# EAGLE design Base (EAGLE 6.3)
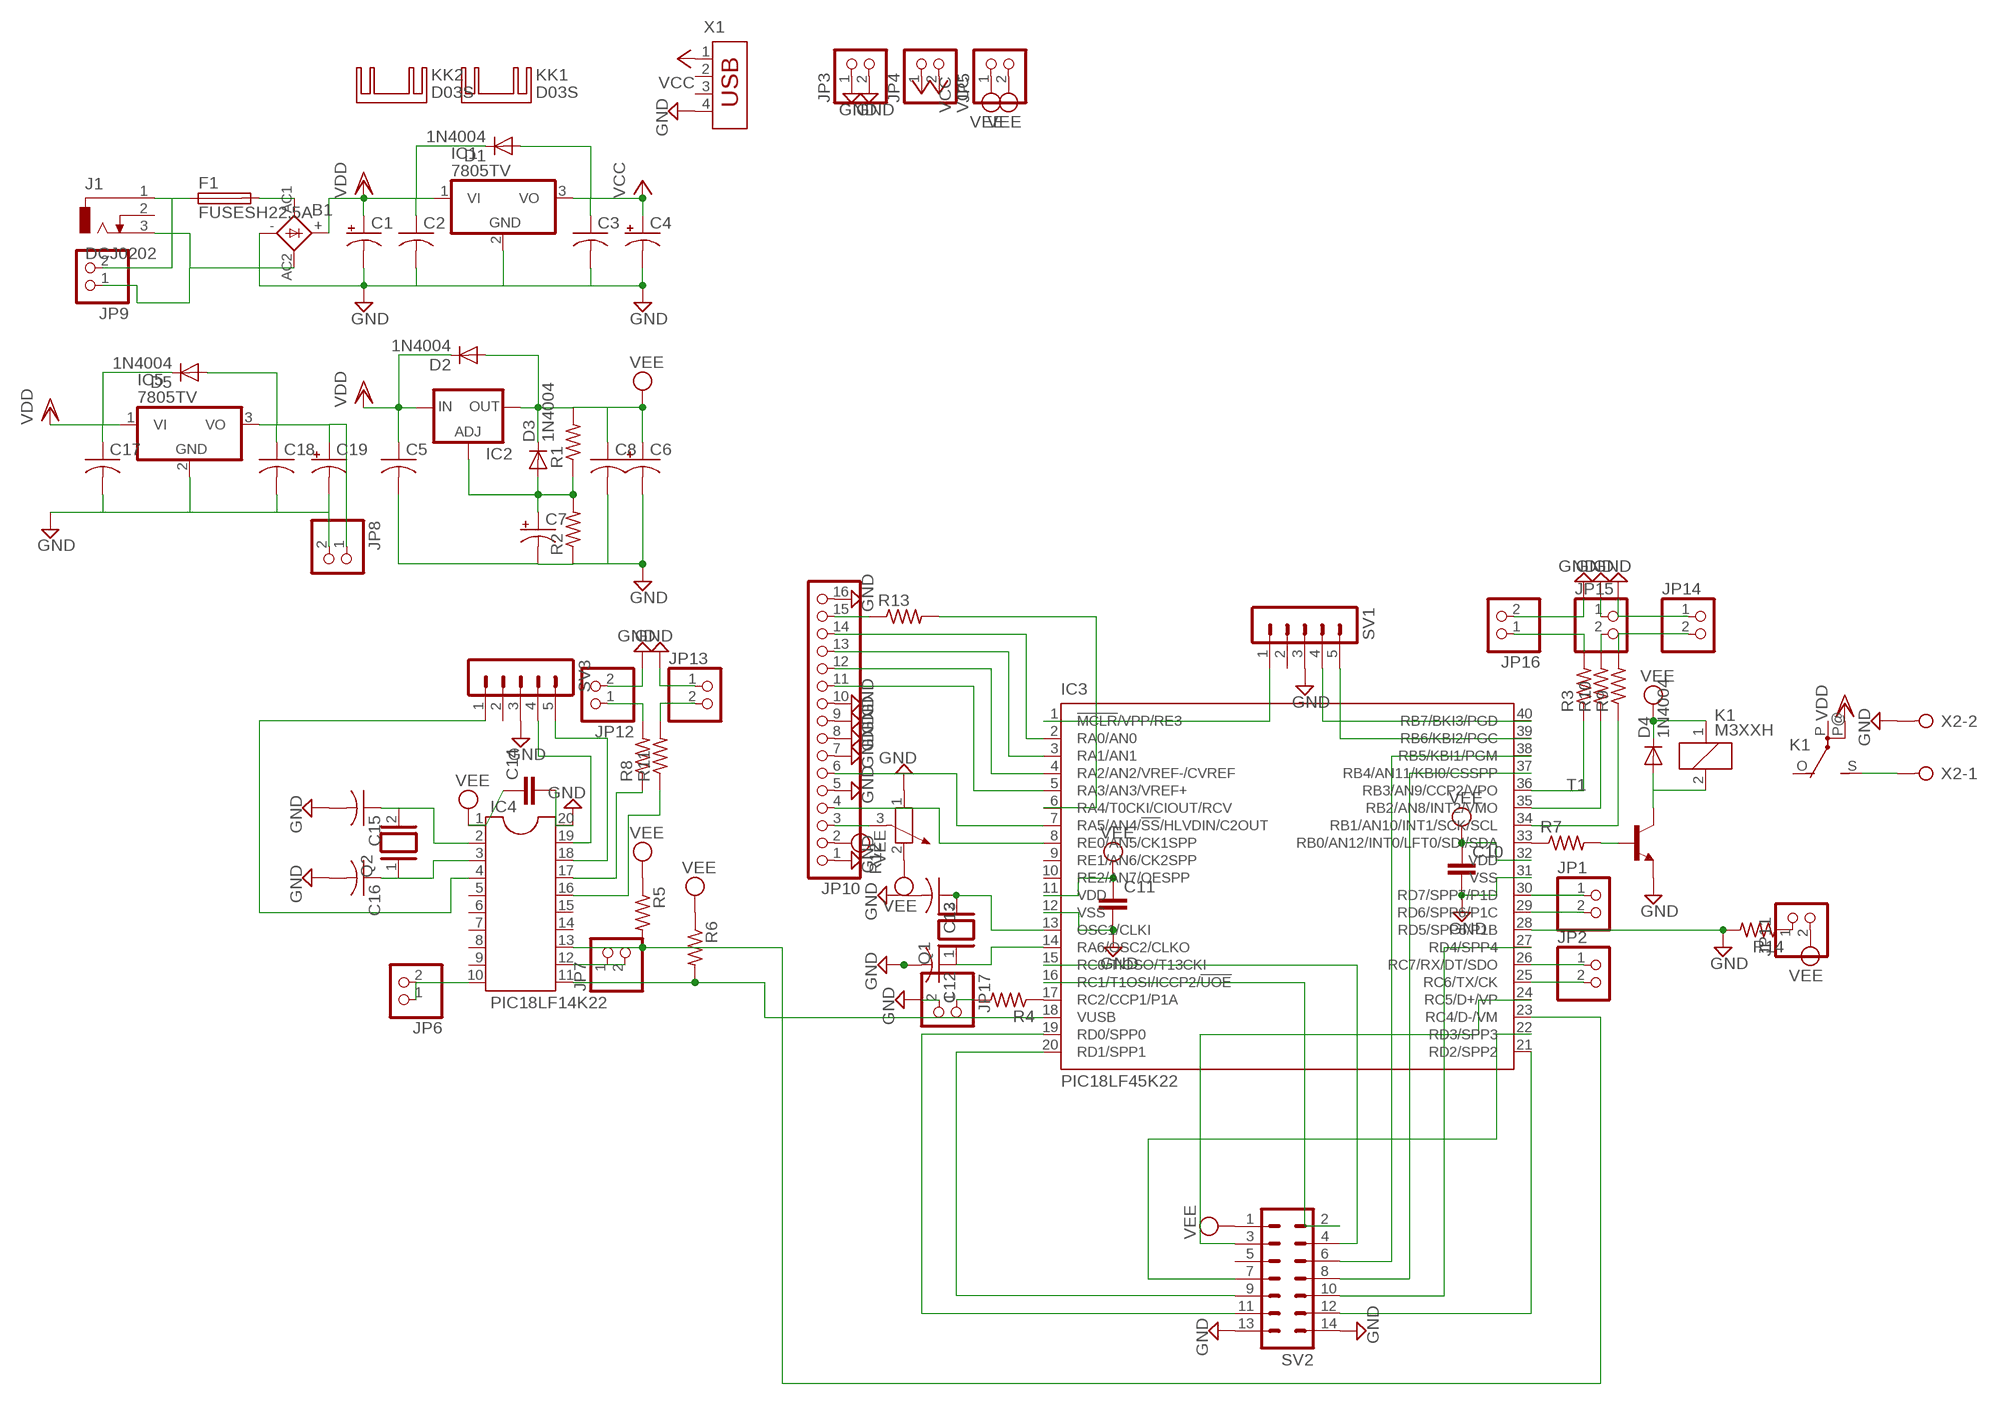
[diagram p0: schematic, sheet 1]

## Parts
B1  1KAB  [1KAB]
C1  CPOL-USE5-13  [E5-13]
C2  C-US050-030X075  [C050-030X075]
C3  C-US050-030X075  [C050-030X075]
C4  CPOL-USE5-13  [E5-13]
C5  C-US050-030X075  [C050-030X075]
C6  CPOL-USE2.5-7  [E2,5-7]
C7  CPOL-USE2.5-5  [E2,5-5]
C8  C-US050-030X075  [C050-030X075]
C10  C-EU025-030X050  [C025-030X050]
C11  C-EU025-030X050  [C025-030X050]
C12  C-US025-030X050  [C025-030X050]
C13  C-US025-030X050  [C025-030X050]
C14  C-EU025-030X050  [C025-030X050]
C15  C-US025-030X050  [C025-030X050]
C16  C-US025-030X050  [C025-030X050]
C17  C-US050-030X075  [C050-030X075]
C18  C-US050-030X075  [C050-030X075]
C19  CPOL-USE5-10.5  [E5-10,5]
D1  1N4004  [DO41-10]
D2  1N4004  [DO41-10]
D3  1N4004  [DO41-10]
D4  1N4004  [DO41-10]
D5  1N4004  [DO41-10]
F1  FUSESH22,5A  [SH22,5A]
IC1  7805TV  [TO220V]
IC2  LM317TS  [317TS]
IC3  PIC18LF45K22  PIC18F4550_40  [DIL40]
IC4  PIC18LF14K22  DIL20  [DIL20]
IC5  7805TV  [TO220V]
J1  DCJ0202  [DCJ0202]
JP1  PINHD-1X2  [1X02]
JP2  PINHD-1X2  [1X02]
JP3  PINHD-1X2  [1X02]
JP4  PINHD-1X2  [1X02]
JP5  PINHD-1X2  [1X02]
JP6  PINHD-1X2  [1X02]
JP7  PINHD-1X2  [1X02]
JP8  PINHD-1X2  [1X02]
JP9  PINHD-1X2  [1X02]
JP10  PINHD-1X16  [1X16]
JP11  PINHD-1X2  [1X02]
JP12  PINHD-1X2  [1X02]
JP13  PINHD-1X2  [1X02]
JP14  PINHD-1X2  [1X02]
JP15  PINHD-1X2  [1X02]
JP16  PINHD-1X2  [1X02]
JP17  PINHD-1X2  [1X02]
K1  M3XXH  [M3XXH]
KK1  D03S  [D03S]
KK2  D03S  [D03S]
Q1  XTAL/S  [QS]
Q2  XTAL/S  [QS]
R1  R-US_0207/10  [0207/10]
R2  R-US_0207/10  [0207/10]
R3  R-US_0207/10  [0207/10]
R4  R-US_0207/10  [0207/10]
R5  R-US_0207/10  [0207/10]
R6  R-US_0207/10  [0207/10]
R7  R-US_0207/10  [0207/10]
R8  R-US_0207/10  [0207/10]
R9  R-US_0207/10  [0207/10]
R10  R-US_0207/10  [0207/10]
R11  R-US_0207/10  [0207/10]
R12  POTENTIOMETER_PT-10  [PT-10]
R13  R-US_0207/10  [0207/10]
R14  R-US_0207/10  [0207/10]
SV1  MA05-1  [MA05-1]
SV2  MA07-2  [MA07-2]
SV3  MA05-1  [MA05-1]
T1  BC547-NPN-TO92-CBE  [TO92-CBE]
X1  USB-787616  [USB]
X2  W237-02P  [W237-132]

## Nets
GND: B1.- C1.- C2.2 C3.2 C4.- C5.2 C6.- C7.- C8.2 C10.2 C11.2 C12.2 C13.2 C14.2 C15.2 C16.2 C17.2 C18.2 C19.- IC1.2(GND) IC3.12(VSS) IC3.28(RD5/SPP5/P1B) IC3.31(VSS) IC4.20 IC5.2(GND) JP3.1 JP3.2 JP8.2 JP10.1 JP10.5 JP10.7 JP10.8 JP10.9 JP10.10 JP10.16 JP12.2 JP13.1 JP14.1 JP15.1 JP16.2 JP17.2 R2.1 R12.1 R14.2 SV1.3 SV2.13 SV2.14 SV3.3 T1.E X1.4 X2.2
N$1: F1.1 J1.1 JP9.2
N$2: B1.AC1 F1.2
N$3: B1.AC2 J1.3 JP9.1
N$4: IC3.1(!MCLR!/VPP/RE3) SV1.1
N$5: C7.+ D3.A IC2.1(ADJ) R1.1 R2.2
N$6: IC3.40(RB7/BKI3/PGD) SV1.4
N$7: IC3.39(RB6/KBI2/PGC) SV1.5
N$8: C13.1 IC3.13(OSC1/CLKI) Q1.2
N$9: C12.1 IC3.14(RA6/OSC2/CLKO) Q1.1
N$10: JP16.1 R3.2
N$11: IC3.26(RC7/RX/DT/SDO) JP2.1
N$12: IC3.25(RC6/TX/CK) JP2.2
N$13: IC3.30(RD7/SPP7/P1D) JP1.1
N$14: IC3.29(RD6/SPP6/P1C) JP1.2
N$15: JP15.2 R10.2
N$16: JP14.2 R9.2
N$17: JP12.1 R8.2
N$18: IC3.19(RD0/SPP0) SV2.11
N$19: IC3.20(RD1/SPP1) SV2.9
N$20: IC3.27(RD4/SPP4) SV2.10
N$21: IC4.19 SV3.4
N$22: IC4.18 SV3.5
N$23: C15.1 IC4.2 Q2.2
N$24: C16.1 IC4.3 Q2.1
N$25: IC4.4 SV3.1
N$26: IC3.23(RC4/D-/VM) IC4.13 R5.2
N$27: IC3.18(VUSB) IC4.11 R6.2
N$28: IC3.16(RC1/T1OSI/ICCP2/!UOE) SV2.2
N$29: R7.2 T1.B
N$30: D4.A K1.2 T1.C
N$31: K1.S(2:S) X2.1
N$32: IC3.21(RD2/SPP2) SV2.12
N$33: IC3.37(RB4/AN11/KBI0/CSSPP) SV2.8
N$34: IC3.38(RB5/KBI1/PGM) SV2.6
N$35: JP13.2 R11.2
N$36: IC4.10 JP6.1 JP6.2
N$37: C18.1 C19.+ D5.A IC5.3(VO) JP8.1
N$38: IC3.15(RC0/TIOSO/T13CKI) SV2.4
N$39: IC3.24(RC5/D+/VP) SV2.3
N$40: IC3.22(RD3/SPP3) SV2.7
N$41: IC3.33(RB0/AN12/INT0/LFT0/SDI/SDA) R7.1
N$42: IC3.34(RB1/AN10/INT1/SCK/SCL) R9.1
N$43: IC4.12 JP7.1 JP7.2
N$44: IC3.35(RB2/AN8/INT2/VMO) R10.1
N$45: IC3.36(RB3/AN9/CCP2/VPO) R3.1
N$46: JP17.1 R4.2
N$47: IC4.17 R8.1
N$48: IC4.16 R11.1
N$49: IC3.2(RA0/AN0) JP10.14
N$50: JP10.3 R12.3
N$51: IC3.7(RA5/AN4/!SS!/HLVDIN/C2OUT) JP10.6
N$52: IC3.8(RE0/AN5/CK1SPP) JP10.4
N$53: IC3.3(RA1/AN1) JP10.13
N$54: IC3.4(RA2/AN2/VREF-/CVREF) JP10.12
N$55: IC3.5(RA3/AN3/VREF+) JP10.11
N$56: IC3.6(RA4/T0CKI/CIOUT/RCV) R13.2
N$57: JP10.15 R13.1
N$58: JP11.1 R14.1
N$59: IC3.17(RC2/CCP1/P1A) R4.1
VCC: C3.1 C4.+ D1.A IC1.3(VO) JP4.1 JP4.2 X1.1
VDD: B1.+ C1.+ C2.1 C5.1 C17.1 D1.C D2.C D5.C IC1.1(VI) IC2.3(IN) IC5.1(VI) K1.P@(2:P)
VEE: C6.+ C8.1 C10.1 C11.1 C14.1 D2.A D3.C D4.C IC2.2(OUT) IC3.11(VDD) IC3.32(VDD) IC4.1 JP5.1 JP5.2 JP10.2 JP11.2 K1.1 R1.2 R5.1 R6.1 R12.2 SV2.1
Unconnected: IC3.9(RE1/AN6/CK2SPP) IC3.10(RE2/AN7/OESPP) IC4.5 IC4.6 IC4.7 IC4.8 IC4.9 IC4.14 IC4.15 J1.2 K1.O(2:O) K1.P(2:P) SV1.2 SV2.5 SV3.2 X1.2 X1.3

## Library data of the parts
B1 = rectifier:1KAB: RECTIFIER grid 5,08 x 5,08 mm
C1 C4 C6 C7 C19 = rcl:CPOL-US: POLARIZED CAPACITOR, American symbol
C2 C3 C5 C8 C12 C13 C15-C18 = rcl:C-US: CAPACITOR, American symbol
C10 C11 C14 = rcl:C-EU: CAPACITOR, European symbol
D1-D5 = diode:1N4004: DIODE general purpose rectifier, 1 A
F1 = fuse:FUSE: Fuse; OC_FARNELL: unknown; OC_NEWARK: unknown
IC1 IC5 = linear:78*: Positive LDO VOLTAGE REGULATOR Source: http://ww1.microchip.com/downloads/en/DeviceDoc/21983A.pdf
IC2 = v-reg:LM317TS: VOLTAGE REGULATOR
IC3 = microchip:PIC18F4*_40: USB Microcontrollers with nanoWatt Technology High-Performance, Enhanced Flash, 28/40/44-Pin, Source: http://ww1.microchip.com/downloads/en/devicedoc/39632c.pdf; MF: MICROCHIP; MPN: PIC18F4550-I/P; OC_FARNELL: 9321357; OC_NEWARK: 74K8623
IC4 = ic-package:DIL20: Dual In Line / Socket
J1 = con-jack:DCJ0202: DC POWER JACK Source: DCJ0202.pdf; OC_FARNELL: unknown; OC_NEWARK: unknown
JP1-JP9 JP11-JP17 = pinhead:PINHD-1X2: PIN HEADER
JP10 = pinhead:PINHD-1X16: PIN HEADER
K1 = relay:M3XXH: RELAY 1 x switch; OC_FARNELL: unknown; OC_NEWARK: unknown
KK1 KK2 = heatsink:D03S: HEATSINK distributor Schukat
Q1 Q2 = special:XTAL/S: CRYSTAL
R1-R11 R13 R14 = resistor:R-US_: RESISTOR, American symbol
R12 = rcl:POTENTIOMETER_: Potentiometer
SV1 SV3 = con-lstb:MA05-1: PIN HEADER; OC_FARNELL: unknown; OC_NEWARK: unknown
SV2 = con-lstb:MA07-2: PIN HEADER; OC_FARNELL: unknown; OC_NEWARK: unknown
T1 = transistor:*-NPN-: NPN Transistror BF959 corrected 2008.03.06
X1 = con-amp:USB-787616: AMP connector
X2 = con-wago-508:W237-02P: WAGO SREW CLAMP; OC_FARNELL: unknown; OC_NEWARK: unknown

## Board
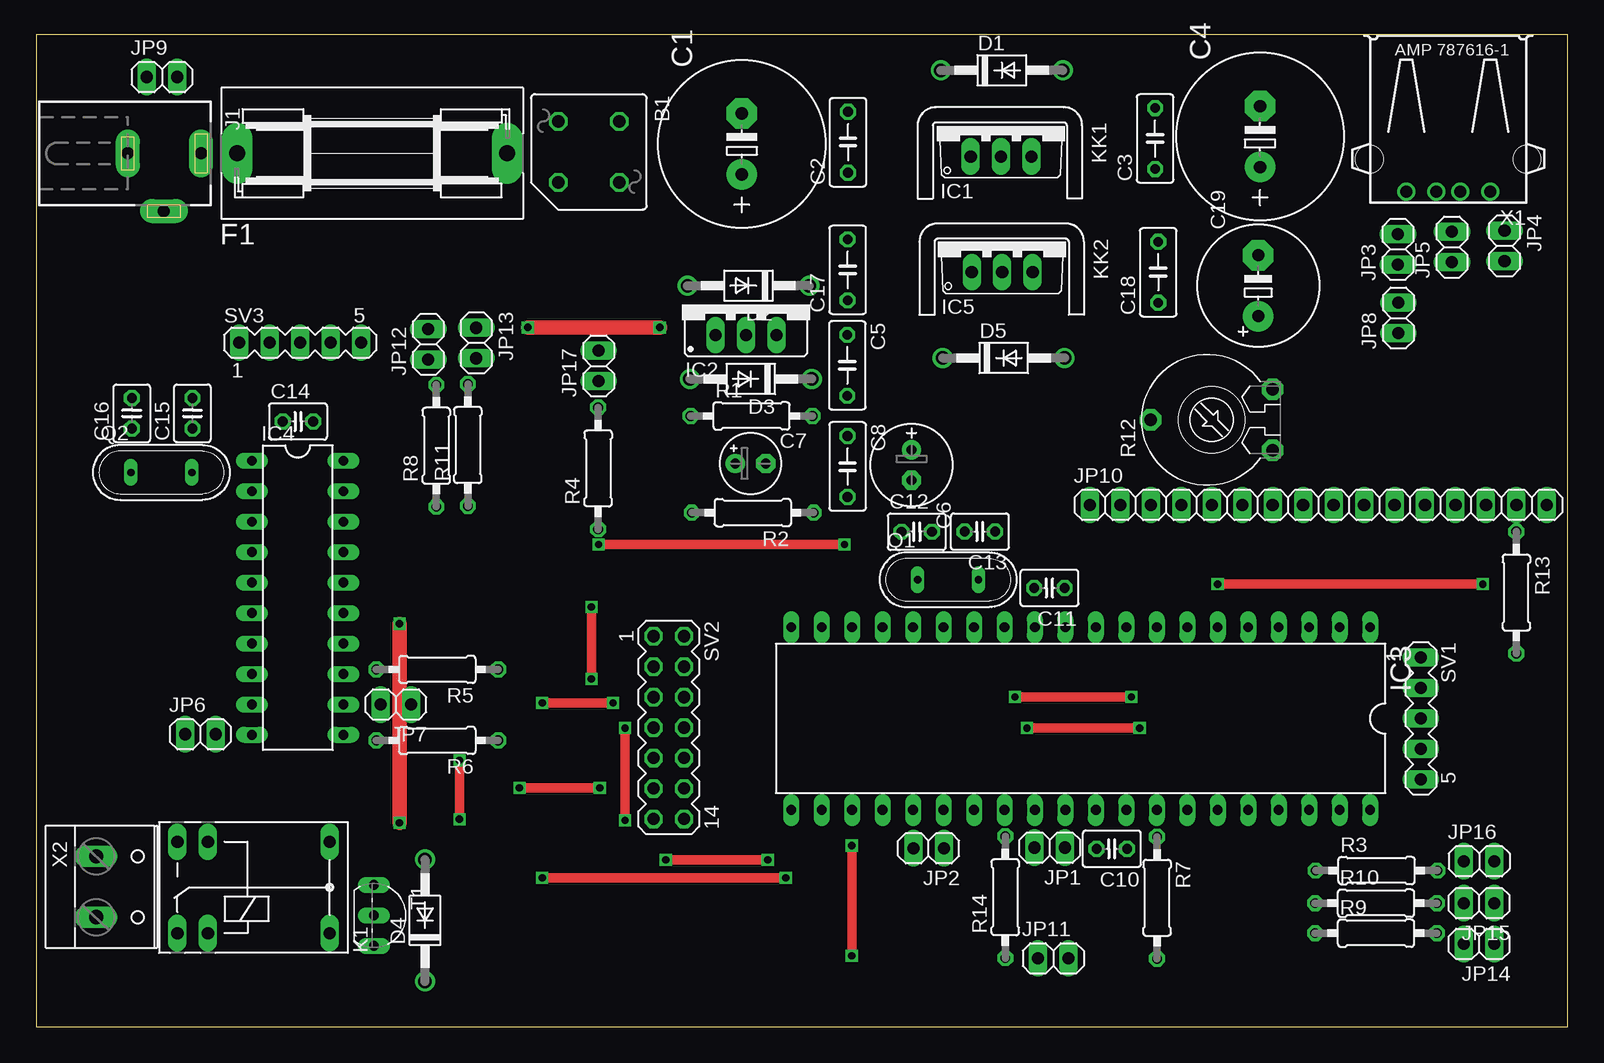
[diagram p1: board, top side]
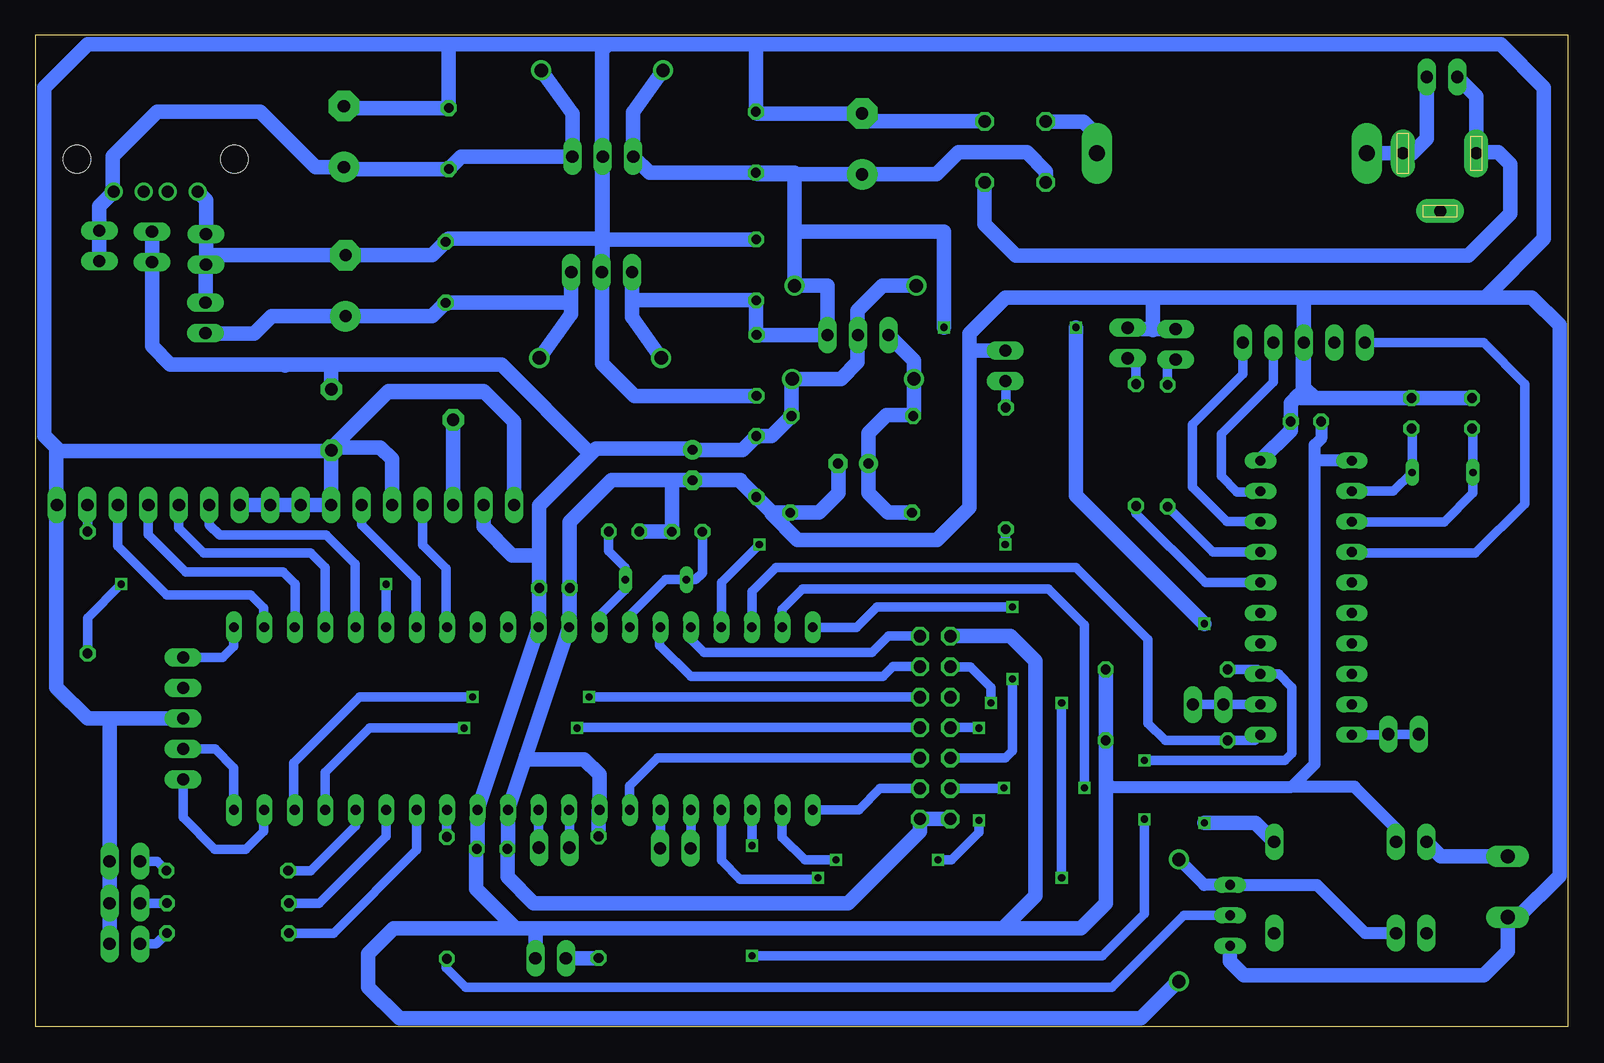
[diagram p2: board, bottom side, seen from below]

Size 127.7 x 82.7 mm. Coordinates in mm from the lower left corner, seen from the top.
Outline: 0,0 127.7,0 127.7,82.7 0,82.7 0,0
Copper layers (1*16): Top 0.035mm / dielectric 1.5mm / Bottom 0.035mm
Design rules "default": minimum track width 10mil, minimum drill 24mil, track to track 8mil, track to pad 8mil, pad to pad 8mil, via to via 8mil, smd to smd 8mil, copper to edge 40mil, drill to drill 8mil, minimum pad ring 10mil, minimum via ring 8mil, stop-mask expansion 4mil, vias tented up to drill 0mil, thermal gap 10mil

### Footprints (pad centres in the part's own frame; a part is rotated, then mirrored left to right if it is on the bottom)
1KAB = drill 1.016 octagon: + 2.54,-2.54; - -2.54,2.54; AC1 -2.54,-2.54; AC2 2.54,2.54
E5-13 = drill 1.016 pad 2.54: + -2.54,0 | drill 1.016 pad 2.54 octagon: - 2.54,0
C050-030X075 = drill 0.813 octagon: 1 -2.54,0; 2 2.54,0
E2,5-7 = drill 0.813 pad 1.6: + -1.27,0 | drill 0.813 pad 1.6 octagon: - 1.27,0
E2,5-5 = drill 0.813 pad 1.6: + -1.27,0 | drill 0.813 pad 1.6 octagon: - 1.27,0
C025-030X050 = drill 0.813 octagon: 1 -1.27,0; 2 1.27,0
E5-10,5 = drill 1.016 pad 2.54: + -2.54,0 | drill 1.016 pad 2.54 octagon: - 2.54,0
DO41-10 = drill 1.118: A 5.08,0; C -5.08,0
SH22,5A = drill 1.321 pad 2.54 long: 1 -11.252,0; 2 11.252,0
TO220V = drill 1.016 long: 1 -2.54,-2.54; 2 0,-2.54; 3 2.54,-2.54
317TS = drill 1.016 long: 1 -2.54,-2.54; 2 0,-2.54; 3 2.54,-2.54
DIL40 = drill 0.813 long: 1 -24.13,-7.62; 2 -21.59,-7.62; 3 -19.05,-7.62; 4 -16.51,-7.62; 5 -13.97,-7.62; 6 -11.43,-7.62; 7 -8.89,-7.62; 8 -6.35,-7.62; 9 -3.81,-7.62; 10 -1.27,-7.62; 11 1.27,-7.62; 12 3.81,-7.62; 13 6.35,-7.62; 14 8.89,-7.62; 15 11.43,-7.62; 16 13.97,-7.62; 17 16.51,-7.62; 18 19.05,-7.62; 19 21.59,-7.62; 20 24.13,-7.62; 21 24.13,7.62; 22 21.59,7.62; 23 19.05,7.62; 24 16.51,7.62; 25 13.97,7.62; 26 11.43,7.62; 27 8.89,7.62; 28 6.35,7.62; 29 3.81,7.62; 30 1.27,7.62; 31 -1.27,7.62; 32 -3.81,7.62; 33 -6.35,7.62; 34 -8.89,7.62; 35 -11.43,7.62; 36 -13.97,7.62; 37 -16.51,7.62; 38 -19.05,7.62; 39 -21.59,7.62; 40 -24.13,7.62
DIL20 = drill 0.813 long: 1 -11.43,-3.81; 2 -8.89,-3.81; 3 -6.35,-3.81; 4 -3.81,-3.81; 5 -1.27,-3.81; 6 1.27,-3.81; 7 3.81,-3.81; 8 6.35,-3.81; 9 8.89,-3.81; 10 11.43,-3.81; 11 11.43,3.81; 12 8.89,3.81; 13 6.35,3.81; 14 3.81,3.81; 15 1.27,3.81; 16 -1.27,3.81; 17 -3.81,3.81; 18 -6.35,3.81; 19 -8.89,3.81; 20 -11.43,3.81
DCJ0202 = drill 1 pad 2 long: 1 0,3.1; 2 4.8,0; 3 0,-3
1X02 = drill 1.016 long: 1 -1.27,0; 2 1.27,0
1X16 = drill 1.016 long: 1 -19.05,0; 2 -16.51,0; 3 -13.97,0; 4 -11.43,0; 5 -8.89,0; 6 -6.35,0; 7 -3.81,0; 8 -1.27,0; 9 1.27,0; 10 3.81,0; 11 6.35,0; 12 8.89,0; 13 11.43,0; 14 13.97,0; 15 16.51,0; 16 19.05,0
M3XXH = drill 1.016 long: 1 -3.81,3.81; 2 -3.81,-3.81; O -6.35,-3.81; P 6.35,-3.81; P@ 6.35,3.81; S -6.35,3.81
QS = drill 0.61 long: 1 -2.54,0; 2 2.54,0
0207/10 = drill 0.813 octagon: 1 -5.08,0; 2 5.08,0
PT-10 = drill 1.016 pad 1.778 octagon: 1 -2.54,-5.08; 2 2.54,-5.08; 3 0,5.08
MA05-1 = drill 1.016 long: 1 -5.08,0; 2 -2.54,0; 3 0,0; 4 2.54,0; 5 5.08,0
MA07-2 = drill 1.016 octagon: 1 -7.62,-1.27; 2 -7.62,1.27; 3 -5.08,-1.27; 4 -5.08,1.27; 5 -2.54,-1.27; 6 -2.54,1.27; 7 0,-1.27; 8 0,1.27; 9 2.54,-1.27; 10 2.54,1.27; 11 5.08,-1.27; 12 5.08,1.27; 13 7.62,-1.27; 14 7.62,1.27
TO92-CBE = drill 0.813 long: B 0,0; C -2.54,0; E 2.54,0
USB = drill 1: 1 -3.5,12.99; 2 -1,12.99; 3 1,12.99; 4 3.5,12.99 | hole 2.3: -6.57,10.28; 6.57,10.28
W237-132 = drill 1.194 long: 1 -2.54,-0.635; 2 2.54,-0.635

### Placement (x,y rotation side)
B1  46.08,72.93 270 top
C1  58.84,73.6 90 top
C2  67.69,73.74 90 top
C3  93.29,74.05 90 top
C4  102.04,74.21 90 top
C5  67.63,55.14 270 top
C6  72.98,46.83 270 top
C7  59.57,46.96 0 top
C8  67.65,46.71 270 top
C10  89.68,14.83 180 top
C11  84.48,36.58 180 top
C12  73.42,41.27 0 top
C13  78.68,41.28 180 top
C14  21.84,50.46 0 top
C15  13.04,51.14 90 top
C16  7.99,51.14 90 top
C17  67.66,63.1 90 top
C18  93.55,62.9 90 top
C19  101.89,61.78 90 top
D1  80.51,79.74 0 top
D2  59.39,61.78 180 top
D3  59.59,54 180 top
D4  32.43,8.86 90 top
D5  80.66,55.75 0 top
F1  28.02,72.82 0 top
IC1  80.45,75.09 0 top
IC2  59.19,60.2 0 top
IC3  87.08,25.69 180 top
IC4  21.82,35.76 270 top
IC5  80.54,65.45 0 top
J1  10.65,72.81 270 top
JP1  84.51,14.93 180 top
JP2  74.41,14.88 180 top
JP3  113.53,64.81 90 top
JP4  122.42,65.09 270 top
JP5  118.03,65.01 90 top
JP6  13.7,24.39 0 top
JP7  30,26.86 180 top
JP8  113.57,59.1 90 top
JP9  10.5,79.18 0 top
JP10  106.9,43.5 0 top
JP11  84.8,5.7 0 top
JP12  32.7,56.9 90 top
JP13  36.7,57 270 top
JP14  120.3,6.9 180 top
JP15  120.3,10.3 180 top
JP16  120.3,13.8 0 top
JP17  46.9,55.1 90 top
K1  18.14,11.61 0 top
KK1  80.35,75.39 180 top
KK2  80.5,65.7 180 top
Q1  76.03,37.27 0 top
Q2  10.45,46.21 0 top
R1  59.65,50.92 0 top
R2  59.75,42.86 180 top
R3  111.75,13.02 0 top
R4  46.86,46.55 90 top
R5  33.45,29.79 180 top
R6  33.45,23.87 180 top
R7  93.45,10.75 270 top
R8  33.37,48.44 90 top
R9  111.7,7.8 0 top
R10  111.7,10.3 0 top
R11  36,48.5 90 top
R12  98,50.6 90 top
R13  123.4,36.2 270 top
R14  80.8,10.8 90 top
SV1  115.44,25.7 270 top
SV2  52.75,24.94 270 top
SV3  22.02,57.03 0 top
T1  28.16,9.28 270 top
X1  117.72,82.61 180 top
X2  5.65,11.67 270 top

### Tracks (layer width: path | path; a pad name or v marks a point on that pad's centre or on a via)
GND
  Bottom 1.2: B1.- 48.66,75.51 58.21,75.51 C1.- 67.55,76.14 C2.2 67.69,81.59 68,81.9 | 80.45,65.7 IC1.2 80.4,72.6 | 80.45,65.7 80.45,63 IC5.2 80.5,62.87 | C7.- 60.8,46.92 60.8,44.5 62.44,42.86 R2.1 66.34,42.86 C8.2 69.04,45.56 | 69.04,45.56 C6.- 73.02,45.6 | C17.2 80.39,65.64 80.45,65.7 | 80.45,65.7 93.29,65.7 C18.2 94.67,64.32 C19.- 113.51,64.32 113.53,64.3 | 113.53,64.3 JP3.2 113.53,68.93 X1.4 | 113.53,64.3 JP3.1 113.57,63.5 JP8.2 | 69.04,45.56 68.96,45.56 | 34.6,60.8 46.9,60.8 49.9,57.8 49.9,56.3 | 34.6,60.8 22,60.8 | 22,60.8 6.9,60.8 | 6.9,60.8 2,65.7 2,78.3 5.6,81.9 68,81.9 | 68,81.9 80,81.9 | 80,81.9 93,81.9 | 93,81.9 123.4,81.9 127,78.3 127,49.3 126,48.3 | 86.85,22.58 IC3.12 83.21,33.37 C11.2 83.21,42.09 79.7,45.6 75,45.6 | 86.85,22.58 IC3.31 88.35,14.89 C10.2 88.4,12.5 86.2,10.3 60,10.3 54,16.3 54,17.3 53.98,17.32 SV2.13 SV2.14 | 75,45.6 73.02,45.6 | IC4.20 23.11,49.71 C14.2 23.11,51.99 22.45,52.65 | C16.2 C15.2 22.21,52.41 22.45,52.65 | 22.45,52.65 22.1,53 22.1,56.95 SV3.3 | C16.2 | C16.2 21.11,52.41 22,53.3 22,60.8 | T1.E 28.16,5.46 27,4.3 7,4.3 5,6.3 5,9.12 X2.2 4.17,9.13 0.7,12.6 0.7,58.5 3,60.8 6.9,60.8 | C13.2 C12.2 74.69,45.29 75,45.6 | 34.6,58.1 34.6,58.3 | 34.6,58.3 34.6,60.8 | 115.54,25.6 SV1.3 122,25.7 | 122,25.7 123.4,25.7 126,28.3 126,43.45 JP10.16 126,42.25 126,48.3 | C4.- 101.88,76.59 C3.2 93.29,81.61 93,81.9 | 80.5,62.87 80.5,55.3 77.8,52.6 C5.2 | 73.02,45.6 69.1,45.6 66.4,42.9 66.4,42.8 64.2,40.6 52.6,40.6 49.9,43.3 49.9,56.3 | JP10.10 JP10.9 JP10.8 JP10.7 R12.1 | 90.3,52.9 90.4,53 98.3,53 103,48.3 103,48.14 R12.1 | JP10.5 98.01,47.31 99,48.3 102.84,48.3 R12.1 | JP10.1 87.85,50.45 90.3,52.9
  Bottom 1.2: 90.3,52.9 98.4,52.9 103.3,48 125.7,48 126,48.3 | R14.2 80.8,18 IC3.28 80.73,21.03 82,22.3 86.56,22.3 86.85,22.58 | JP13.1 36.6,58.17 JP12.2 34.47,58.17 34.6,58.3 | JP16.2 JP15.1 JP14.1 121.57,25.27 122,25.7 | JP17.2 49.83,56.37 49.9,56.3 | 80.5,62.87 80.5,81.4 80,81.9
N$1
  Bottom 1.2: F1.1 14.66,72.81 J1.1 13,72.8 11.77,74.03 JP9.2
N$2
  Bottom 1.2: B1.AC1 40.37,75.47 39.3,74.4 39.3,72.85 F1.2
N$3
  Bottom 1.2: 7.65,73.3 J1.3 | 7.65,73.3 7.65,77.6 JP9.1 | B1.AC2 48.62,66.92 46,64.3 8.3,64.3 4.8,67.8 4.8,71.9 5.8,72.9 7.25,72.9 7.65,73.3
N$4
  Bottom 0.8: SV1.1 112.12,30.78 111.2,31.7 IC3.1
N$5
  Bottom 1.2: IC2.1 54.51,55.52 D3.A 54.51,50.98 R1.1 54.65,51 56.8,51 58.3,49.5 C7.+ 58.3,44.5 56.66,42.86 R2.2
N$6
  Bottom 0.8: SV1.4 112.76,23.16 111.2,21.6 IC3.40
N$7
  Bottom 0.8: SV1.5 115.44,17.44 112.8,14.8 110.2,14.8 108.7,16.3 108.7,18.04 IC3.39
N$8
  Bottom 0.8: C13.1 79.95,39.65 78.6,38.3 78.6,37.3 | 78.6,37.3 Q1.2 | 78.6,37.3 78.6,36.4 80.7,34.3 80.7,33.34 IC3.13
N$9
  Bottom 0.8: IC3.14 78.2,34.3 75.23,37.27 Q1.1 73.46,37.3 72.7,37.3 72.15,37.85 C12.1
N$10
  Bottom 0.8: JP16.1 117.61,13.8 R3.2
N$11
  Bottom 0.8: JP2.1 75.65,14.88 IC3.26
N$12
  Bottom 0.8: JP2.2 73.11,14.88 IC3.25
N$13
  Bottom 0.8: IC3.30 85.81,14.96 JP1.1
N$14
  Bottom 0.8: JP1.2 83.24,18.04 IC3.29
N$15
  Bottom 0.8: JP15.2 R10.2
N$16
  Bottom 0.8: JP14.2 117.68,6.9 R9.2
N$17
  Bottom 0.8: R8.2 33.37,54.96 JP12.1
N$18  (via drill 0.6)
  Top 0.8: v47,19.9 v40.3,19.9
  Bottom 0.8: SV2.11 47.04,19.86 v47,19.9 | v40.3,19.9 40.3,33.5 43.3,36.5 63.8,36.5 65.5,34.8 IC3.19
N$19  (via drill 0.6)
  Top 0.8: v46.3,29 v46.3,35
  Bottom 0.8: SV2.9 46.9,22.4 46.3,23 v46.3,29 | v46.3,35 57.6,35 59.3,33.3 IC3.20
N$20
  Bottom 0.8: SV2.10 75.9,22.4 78.2,20.1 IC3.27
N$21
  Bottom 0.8: SV3.4 24.56,53.74 28.9,49.4 28.9,45.9 27.6,44.6 25.68,44.6 IC4.19
N$22
  Bottom 0.8: IC4.18 28.41,42.11 31.3,45 31.3,50.2 27.1,54.4 SV3.5
N$23
  Bottom 0.8: IC4.2 14.55,44.65 Q2.2 12.99,49.82 C15.1
N$24
  Bottom 0.8: C16.1 7.91,49.79 Q2.1 7.91,44.49 10.3,42.1 IC4.3
N$25
  Bottom 0.8: SV3.1 7.03,57.03 3.6,53.6 3.6,43.6 7.7,39.5 17.94,39.5 IC4.4
N$26  (via drill 0.6)
  Top 0.8: v35.3,22.2 v35.3,17.3 | v68,5.9 v68,15.1
  Bottom 0.8: IC4.13 26.01,29.79 R5.2 25.89,29.79 25.5,29.4 24.1,29.4 23,28.3 23,22.8 23.6,22.2 v35.3,22.2 | v35.3,17.3 35.3,9.4 38.8,5.9 v68,5.9 | v68,15.1 68,18.04 IC3.23
N$27
  Bottom 0.8: IC4.11 26.09,23.87 R6.2 33.57,23.87 35,25.3 35,32.3 41,38.3 66,38.3 68,36.3 68,33.34 IC3.18
N$28
  Bottom 0.8: SV2.2 56.64,32.56 58,31.2 72,31.2 73.1,32.3 IC3.16
N$29
  Bottom 0.8: T1.B 28.18,9.3 32,9.3 38,3.3 91.9,3.3 93.5,4.9 93.5,5.62 R7.2
N$30
  Bottom 1: D4.A 30.31,11.82 T1.C 28.14,11.8 20.9,11.8 16.9,7.8 K1.2
N$31
  Bottom 1.2: X2.1 10.58,14.21 K1.S
N$32
  Bottom 0.8: SV2.12 57.34,19.86 59.1,18.1 62.92,18.1 IC3.21
N$33  (via drill 0.6)
  Top 0.8: v82.6,24.9 v92,24.9
  Bottom 0.8: SV2.8 82.56,24.94 v82.6,24.9 | v92,24.9 99.9,24.9 103.6,21.2 IC3.37
N$34  (via drill 0.6)
  Top 0.8: v81.6,27.5 v91.3,27.5
  Bottom 0.8: SV2.6 81.58,27.48 v81.6,27.5 | v91.3,27.5 100.7,27.5 106.2,22 106.2,18.14 IC3.38
N$35
  Bottom 0.8: R11.2 36,55.03 JP13.2
N$36
  Bottom 0.8: IC4.10 15.03,24.33 JP6.2 JP6.1
N$37
  Bottom 1.2: IC5.3 83.08,60.7 | 83.08,60.7 83.08,59.41 D5.A | 83.08,60.7 83.42,60.36 C18.1 94.67,59.24 C19.+ 108.06,59.24 109.5,57.8 113.54,57.8 JP8.1
N$38
  Bottom 0.8: SV2.4 56.28,30.02 57.1,29.2 73.1,29.2 75.7,31.8 75.7,33.26 IC3.15
N$39  (via drill 0.6)
  Top 0.8: v62.5,12.4 v42.2,12.4 | v42.2,27 v48.1,27
  Bottom 0.8: IC3.24 70.57,13.87 69,12.3 62.6,12.3 v62.5,12.4 | v42.2,12.4 v42.2,27 | v48.1,27 48.1,28.3 49.8,30 51.46,30 SV2.3
N$40  (via drill 0.6)
  Top 0.8: v49.1,24.9 v49.1,17.2 | v52.5,13.9 v61,13.9
  Bottom 0.8: SV2.7 49.14,24.94 v49.1,24.9 | v49.1,17.2 49.1,16.2 51.4,13.9 v52.5,13.9 | v61,13.9 63.6,13.9 65.5,15.8 IC3.22
N$41
  Bottom 0.8: R7.1 93.45,18.05 IC3.33
N$42
  Bottom 0.8: IC3.34 95.97,14.73 102.9,7.8 R9.1
N$43
  Bottom 0.8: IC4.12 JP7.2 JP7.1
N$44
  Bottom 0.8: IC3.35 98.51,15.89 104.1,10.3 R10.1
N$45
  Bottom 0.8: IC3.36 101.05,16.75 104.8,13 106.65,13 R3.1
N$46
  Bottom 0.8: R4.2 46.86,53.79 JP17.1
N$47
  Bottom 0.8: IC4.17 29.58,39.57 R8.1
N$48
  Bottom 0.8: IC4.16 30.23,37.03 36,42.8 R11.1
N$49
  Bottom 0.8: JP10.14 120.87,40.07 116.8,36 109.8,36 108.7,34.9 108.7,33.34 IC3.2
N$50
  Bottom 1.2: R12.3 JP10.3
N$51
  Bottom 0.8: JP10.6 100.55,41.85 96,37.3 96,33.34 IC3.7
N$52
  Bottom 0.8: JP10.4 95.47,40.17 93.5,38.2 93.5,33.38 IC3.8
N$53
  Bottom 0.8: JP10.13 118.33,41.03 115.2,37.9 107.1,37.9 106.1,36.9 106.1,33.34 IC3.3
N$54
  Bottom 0.8: JP10.12 115.79,41.59 113.7,39.5 104.8,39.5 103.6,38.3 IC3.4
N$55
  Bottom 0.8: JP10.11 113.25,41.85 112.4,41 103.5,41 101.1,38.6 101.1,33.36 IC3.5
N$56  (via drill 0.6)
  Top 0.8: v120.6,36.9 v98.5,36.9
  Bottom 0.8: R13.2 123.4,34.1 v120.6,36.9 | v98.5,36.9 IC3.6
N$57
  Bottom 0.8: R13.1 JP10.15
N$58
  Bottom 1.2: R14.1 83.51,5.72 JP11.1
N$59  (via drill 0.6)
  Top 0.8: v67.4,40.2 v46.9,40.2
  Bottom 0.8: IC3.17 70.57,37.03 v67.4,40.2 | v46.9,40.2 46.9,41.43 R4.1
VCC
  Bottom 1.2: D1.A 82.99,76.14 IC1.3 92.25,72.55 C3.1 101.88,71.51 C4.+ 104.37,71.67 109,76.3 117.6,76.3 121.3,72.6 121.3,69.54 | JP4.2 JP4.1 122.42,68.42 121.3,69.54 | 121.3,69.54 X1.1
VDD  (via drill 0.6)
  Top 1.2: v30.3,33.6 v30.3,17 | v41,58.3 v52,58.3
  Bottom 1.2: D1.C 77.91,76.26 IC1.1 76.56,71.2 C2.1 | IC2.3 61.73,61.69 61.82,61.78 D2.C 64.47,66.3 | IC2.3 61.75,57.68 C5.1 67.66,57.71 C17.1 77.86,60.56 78,60.7 | IC5.1 78,60.7 | 78,60.7 78,59.17 D5.C | IC2.3 61.73,61.77 | v30.3,17 26.07,17 K1.P@ | B1.+ 43.5,70.43 43.5,71.3 45.1,72.9 50.8,72.9 52.64,71.06 C1.+ 67.55,71.06 C2.1 | C2.1 64.47,71.2 64.47,66.3 | v30.3,33.6 41,44.3 v41,58.3 | v52,58.3 52,66.3 64.47,66.3
VEE
  Bottom 1: R6.1 R5.1 | 38.23,20 23,20 | 23,20 21.1,21.9 21.1,47.3 | 21.1,47.3 21.1,48.5 20.57,49.03 C14.1 | K1.1 14.33,16.53 17.8,20 23,20 | IC4.1 20.99,47.19 21.1,47.3
  Bottom 1.2: D2.A 57.12,61.78 59.2,59.7 IC2.2 59.2,55.4 60.6,54 D3.C 64.73,53.94 R1.2 66.4,49.25 C8.1 68.8,48.1 C6.+ 73.08,48.2 81,48.2 81.45,47.75 | JP5.2 JP5.1 118.03,56.73 116.5,55.2 107,55.2 | SV2.1 46.46,32.56 44.4,30.5 44.4,10.9 47.1,8.2 | 47.1,8.2 86,8.2 | 86,8.2 87.7,8.2 | 87.7,8.2 91,11.5 91,14.78 C10.1 90.89,14.89 IC3.32 IC3.11 85.75,33.37 C11.1 85.75,39.3 | R5.1 38.53,20.3 | 38.53,20.3 38.53,10.27 40.6,8.2 47.1,8.2 | 38.23,20 38.53,20.3 | D4.C 32.52,3.78 35.6,0.7 97.4,0.7 100,3.3 100,6.1 97.9,8.2 87.7,8.2 | 107,55.2 103,55.2 | 85.75,39.3 85.75,43.45 81.45,47.75 | 106.94,55.14 107,55.2 | R12.2 103.08,55.12 103,55.2 | JP10.2 90.39,41.69 88,39.3 85.75,39.3 | JP11.2 86.07,8.13 86,8.2 | 103,55.2 88.9,55.2 81.45,47.75